# EAGLE design esp-rev2 (EAGLE 7.1.0)
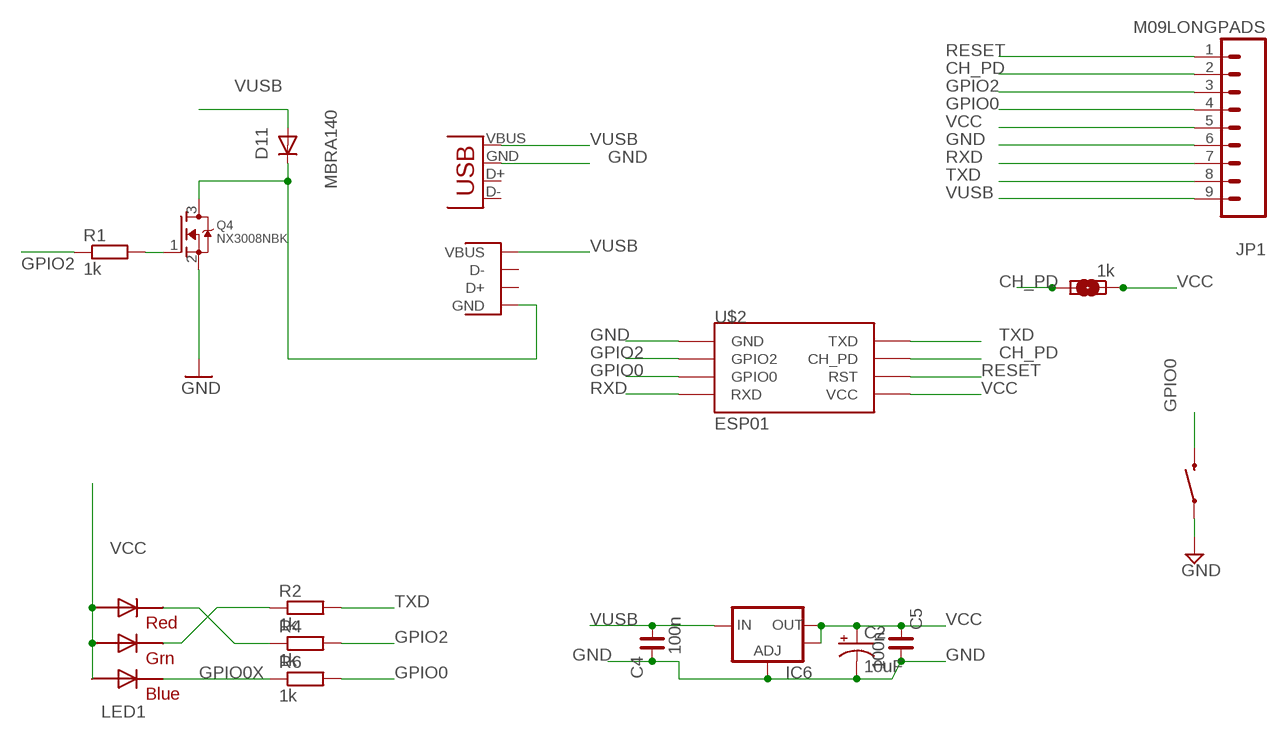
[diagram p0: schematic, sheet 1]

## Parts
C2  10uF  CAP_POL1206  [EIA3216]
C4  100n  C_0603  [C0603]
C5  100n  C_0603  [C0603]
D11  MBRA140  DIODESOD  [SOD-323]
IC6  V_REG_LM1117SOT223  [SOT223]
JP1  M09LONGPADS  [1X09_LONGPADS]
LED1  RGBLED5050  [RGBLED5050]
PWR2  SOLDERJUMPERTRACE  [SJ_2S-TRACE]
Q4  NX3008NBK  MOSFET-NWIDE  [SOT23-WIDE]
R1  1k  R-EU_R0603  [R0603]
R2  1k  R-EU_R0603  [R0603]
R4  1k  R-EU_R0603  [R0603]
R6  1k  R-EU_R0603  [R0603]
R8  1k  R-EU_R0603  [R0603]
RESET1  SWITCH-MOMENTARY-2-SMD-1101NE  [TACTILE-SWITCH-1101NE]
U$2  ESP01  [ESP01]
X1  USB-A-H  [USB-A-H]
X3  USB-A-H  [USB-A-H]

## Nets
CH_PD: JP1.2 PWR2.1 R8.2 U$2.CH_PD
GND: C2.C(-) C4.2 C5.1 IC6.1(ADJ) JP1.6 Q4.2(S) RESET1.P$1 U$2.GND X3.GND(VBUS)
GPIO0: JP1.4 R6.2 RESET1.P$2 U$2.GPIO0
GPIO0X: LED1.4(BLUE_C) R6.1
GPIO2: JP1.3 R1.1 R4.2 U$2.GPIO2
N$1: LED1.5(RED_C) R4.1
N$2: LED1.6(GREEN_C) R2.1
N$3: Q4.1(G) R1.2
N$7: D11.1(C) Q4.3(D) X1.GND
RESET: JP1.1 U$2.RST
RXD: JP1.7 U$2.RX(RXD)
TXD: JP1.8 R2.2 U$2.TX(TXD)
VCC: C2.A(+) C5.2 IC6.2(OUT) IC6.4(OUT) JP1.5 LED1.1(GREEN_A) LED1.2(RED_A) LED1.3(BLUE_A) PWR2.2 R8.1 U$2.VCC
VUSB: C4.1 D11.2(A) IC6.3(IN) JP1.9 X1.VBUS X3.VBUS(GND)
Unconnected: X1.D+ X1.D- X3.D+(D-) X3.D-(D+)

## Library data of the parts
C2 = SparkFun:CAP_POL: Capacitor Polarized These are standard SMD and PTH capacitors. Normally 10uF, 47uF, and 100uF in electrolytic and tantalum varieties. Always verify the external diameter of the through hole cap, it varies with capacity, voltage, and manufacturer. The EIA devices should be standard.
C4 C5 = rc-master-smd:C_: NON-POLARIZED CAP
D11 = SparkFun:DIODE: Diode These are standard reverse protection diodes and small signal diodes. SMA package can handle up to about 1A. SOD-323 can handle about 200mA. What the SOD-323 package when ordering, there are some mfgs out there that are 5-pin packages.
IC6 = SparkFun:V_REG_LM1117: Voltage Regulator LM1117 Standard adjustable voltage regulator but in SMD form. Spark Fun Electronics SKU : COM-00595
JP1 = SparkFun-Connectors:M09: Header 9 Standard 9-pin 0.1" header. Use with straight break away headers (SKU : PRT-00116), right angle break away headers (PRT-00553), swiss pins (PRT-00743), machine pins (PRT-00117), and female headers (PRT-00115).
LED1 = adafruit:RGBLED: For 5050 RGB LEDs, the order of the LEDs may vary from one manufacturer to another!
PWR2 = SparkFun:SOLDERJUMPER: Solder Jumper Standard SMD solder jumper. Used to automate production. Two varients : Normally Open and Normally Closed are the same, but have different paste layers. NC will have a large amount of paste and should jumper during reflow.
Q4 = microbuilder:MOSFET-N: N-Channel Mosfet LEGEND VDS: Voltage Drain-Source ID: Drain Current RDS(ON): Drain-Source On-State Resistance VGS(TH): Gate-Source Threshold Voltage CISS: Drain-Source Input Capacitance SOT-23 Name VDS ID RDS(ON) VGS(TH) CISS Order Number 2N7002E 60V 260mA 2.5 Ohm 2.5V @ 250uA 26.7pF @ 25V 2N7002ET1GOSTR-ND BSH103 30V 850mA 400 mOhm 400mV @ 1mA 83pF @ 24V BSH103,235-ND BSS138 60V 320mA 1.6 Ohm 1.5V @ 250uA 50pF @ 10V Mouser: 771-BSS138PW115 DMN2075U-7 20V 4.2A 38 mOhm 1V @ 250 uA 594.3pF @ 10V DMN2075U-7DICT-ND * BSS138 good choice for I2C level-shifting
R1 R2 R4 R6 R8 = resistor:R-EU_: RESISTOR, European symbol
RESET1 = SparkFun:SWITCH-MOMENTARY-2
U$2 = esp8266modules:ESP01: ESP8266 Wifi module 01
X1 = CH_connectors:USB: USB Connectors USB-B-PTH is C@H proven USB-A-H is C@H proven
X3 = SparkFun:USB: USB Connectors USB-B-PTH is fully proven SKU : PRT-00139 USB-miniB is fully proven SKU : PRT-00587 USB-A-PCB is untested. USB-A-H is throughly reviewed, but untested. Spark Fun Electronics SKU : PRT-00437 USB-B-SMT is throughly reviewed, but untested. Needs silkscreen touching up. USB-A-S has not been used/tested USB-MB-H has not been used/tested

## Net classes
0 default: width 0.254 mm, drill 0.381 mm, clearance 0.254 mm
1 GND: width 0.254 mm, drill 0.381 mm, clearance 0.254 mm
2 pwr: width 0.254 mm, drill 0.381 mm, clearance 0.254 mm

## Board
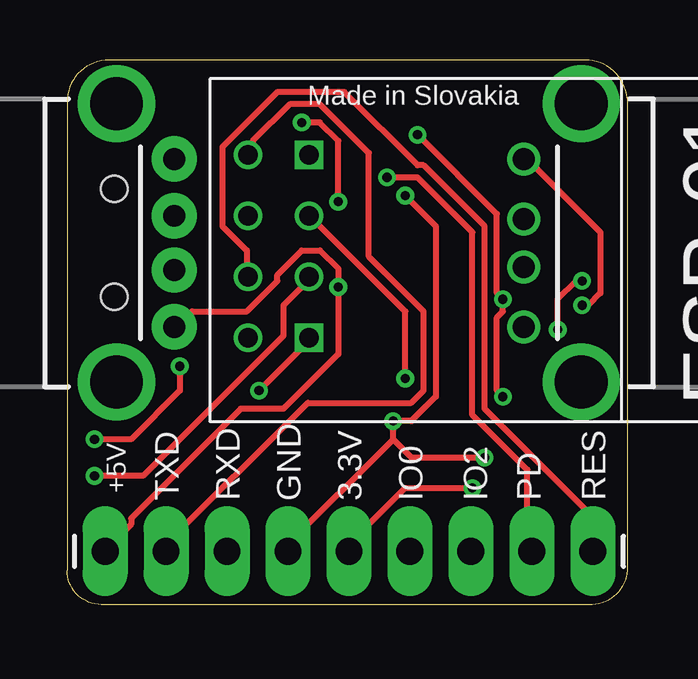
[diagram p1: board, top side]
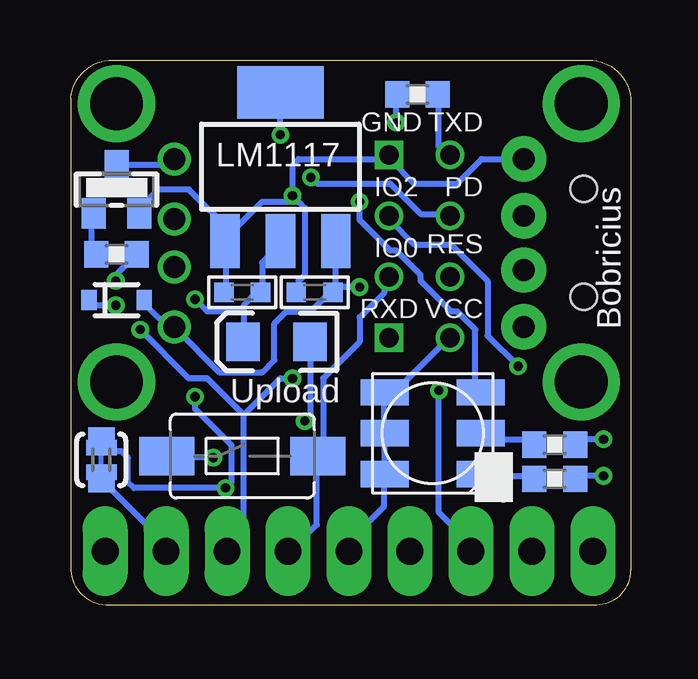
[diagram p2: board, bottom side, seen from below]

Size 23.34 x 22.71 mm. Coordinates in mm from the lower left corner, seen from the top.
Outline: 23.34,21.11 arc90 21.43,22.7 1.75,22.7 arc90 0,20.96 0,1.43 arc90 1.43,0 21.75,0 arc90 23.34,1.43 23.34,21.11
Copper layers (1*16): Top 0.0356mm / dielectric 1.5011mm / Bottom 0.0356mm
Design rules "LaenPCBOrder (1) *": minimum track width 6mil, minimum drill 13mil, track to track 8mil, track to pad 8mil, pad to pad 8mil, via to via 8mil, smd to smd 6mil, copper to edge 15mil, drill to drill 6mil, minimum pad ring 7mil, minimum via ring 7mil, stop-mask expansion 4mil, vias tented up to drill 30mil, thermal gap 10mil

### Footprints (pad centres in the part's own frame; a part is rotated, then mirrored left to right if it is on the bottom)
EIA3216 = smd 1.4 x 1.6: A 1.4,0; C -1.4,0
C0603 = smd 0.8 x 0.8: 1 -0.762,0; 2 0.762,0
SOD-323 = smd 0.63 x 0.83: 1 -1.15,0; 2 1.15,0
SOT223 = smd 1.219 x 2.235: 1 -2.311,-3.099; 2 0,-3.099; 3 2.311,-3.099 | smd 3.6 x 2.2: 4 0,3.099
1X09_LONGPADS = drill 1.118 pad 1.88 long: 1 0,0; 2 2.54,0; 3 5.08,0; 4 7.62,0; 5 10.16,0; 6 12.7,0; 7 15.24,0; 8 17.78,0; 9 20.32,0
RGBLED5050 = smd 2 x 1.1: 1 -2,1.7; 2 -2,0; 3 -2,-1.7; 4 2,-1.7; 5 2,0; 6 2,1.7
SJ_2S-TRACE = smd 0.635 x 1.27: 1 -0.508,0; 2 0.508,0
SOT23-WIDE = smd 1 x 1.27: 1 -0.95,-1; 2 0.95,-1; 3 0,1
R0603 = smd 1 x 1.1: 1 -0.85,0; 2 0.85,0
TACTILE-SWITCH-1101NE = smd 2.3 x 1.6: P$1 -3.15,0; P$2 3.15,0
ESP01 = drill 0.8: CH_PD -1.285,-8.178; GPIO0 1.255,-5.638; GPIO2 -1.285,-5.638; RST 1.255,-8.178; TX -3.825,-8.178; VCC 3.795,-8.178 | drill 0.8 square: GND -3.825,-5.638; RX 3.795,-5.638
USB-A-H = drill 0.914: D+ 2.4,-1; D- 2.4,1; GND 2.4,-3.5; VBUS 2.4,3.5 | drill 2.2: GND@1 0,5.8; GND@2 0,-5.8
USB-A-H' = drill 0.914 pad 1.88: D+ 2.4,1.127; D- 2.4,-1.127; GND 2.4,3.5; VBUS 2.4,-3.5 | drill 2.2: GND2 0,-5.8; GND3 0,5.8 | hole 1.1: -0.1,2.25; -0.1,-2.25

### Placement (x,y rotation side)
C2  14.76,10.95 180 bottom
C4  13.18,13.02 180 bottom
C5  16.19,13.02 0 bottom
D11  21.43,12.7 0 bottom
IC6  14.61,18.26 0 bottom
JP1  21.91,2.22 180 top
LED1  8.25,7.14 0 bottom
PWR2  22.07,6.03 90 bottom
Q4  21.43,17.3 0 bottom
R1  21.43,14.61 180 bottom
R2  8.89,21.27 0 bottom
R4  3.18,6.67 0 bottom
R6  3.18,5.24 0 bottom
R8  22.07,6.03 270 bottom
RESET1  16.19,6.19 0 bottom
U$2  15.72,14.92 270 top
X1  21.43,15.08 180 top
X3  USB-A-H  [USB-A-H']  2.06,15.08 0 top

### Tracks (layer width: path | path; a pad name or v marks a point on that pad's centre or on a via)
CH_PD  (via drill 0.38)
  Top 0.254: v13.34,17.81 14.61,17.81 16.89,15.53 16.89,7.91 19.18,5.62 19.18,2.32 JP1.2
  Bottom 0.254: PWR2.1 22.23,5.37 R8.2 21.97,5.11 19.18,2.32 JP1.2 | v13.34,17.81 13.08,17.56 10.03,17.56 8.76,16.29 7.75,16.29 U$2.CH_PD
GND  (via drill 0.38)
  Top 0.254: 13.59,6.89 v13.59,7.65 14.35,7.65 15.37,8.67 15.37,15.78 v14.1,17.05 | 13.59,6.89 9.02,2.32 JP1.6 | v17.4,6.13 14.35,6.13 13.59,6.89
  Bottom 0.254: v13.59,7.65 13.34,7.91 13.34,10.95 C2.C | v17.4,6.13 19.18,6.13 RESET1.P$1 | 14.1,16.8 15.37,16.8 16.64,15.53 | 14.1,16.8 13.84,16.8 13.59,16.54 13.59,13.75 13.84,13.49 13.84,13.24 C4.2 | 16.64,15.53 16.89,15.27 IC6.1 | C5.1 16.89,13.24 16.89,15.02 IC6.1 | 16.64,15.53 18.41,17.3 19.69,17.3 20.45,16.54 Q4.2 | 16.64,15.53 IC6.1 | 14.1,16.8 v14.1,17.05 14.1,18.32 13.84,18.57 10.29,18.57 U$2.GND 10.03,18.57 9.02,17.56 7.24,17.56 6.22,18.57 4.7,18.57 X3.GND
GPIO0  (via drill 0.38)
  Top 0.254: v1.14,5.37 3.18,5.37 9.02,11.21 9.02,12.48 10.03,13.49 U$2.GPIO0
  Bottom 0.254: JP1.4 14.1,2.32 13.08,3.33 13.08,6.13 RESET1.P$2 12.83,6.38 12.83,9.43 11.3,10.95 11.3,11.97 10.29,12.99 10.29,13.49 U$2.GPIO0 | v1.14,5.37 2.16,5.37 R6.2
GPIO0X
  Bottom 0.254: R6.1 4.19,5.37 6.22,5.37 LED1.4
GPIO2  (via drill 0.38)
  Top 0.254: v1.14,6.89 2.67,6.89 4.7,8.92 v4.7,9.94 | v21.46,13.49 21.21,13.49 20.45,12.73 v20.45,11.46 | v14.1,9.43 14.1,12.22 10.29,16.03 U$2.GPIO2
  Bottom 0.254: v1.14,6.89 2.16,6.89 R4.2 | v4.7,9.94 5.97,11.21 5.97,13.49 7.49,15.02 9.02,15.02 10.03,16.03 U$2.GPIO2 | v21.46,13.49 21.46,13.75 20.7,14.51 R1.1 | v20.45,11.46 18.41,9.43 17.65,9.43 16.13,7.91 | 16.13,7.91 16.13,2.83 16.64,2.32 JP1.3 | v14.1,9.43 14.61,9.43 16.13,7.91
N$1
  Bottom 0.254: R4.1 4.19,6.89 5.97,6.89 6.22,7.14 LED1.5
N$2  (via drill 0.38)
  Top 0.254: v9.78,20.1 10.54,20.1 11.3,19.34 v11.3,16.8
  Bottom 0.254: v9.78,20.1 9.78,21.11 R2.1 | v11.3,16.8 11.3,16.03 10.03,14.76 9.78,14.76 8.76,13.75 8.76,13.49 7.49,12.22 7.24,12.22 6.48,11.46 6.48,8.92 LED1.6
N$3
  Bottom 0.254: R1.2 22.48,14.76 22.48,16.29 Q4.1
N$7  (via drill 0.38)
  Top 0.254: v21.46,12.48 21.72,12.48 22.23,12.99 22.23,15.53 19.18,18.57 X1.GND
  Bottom 0.254: v21.46,12.48 22.48,12.48 D11.1 | Q4.3 21.21,18.32 19.43,18.32 19.18,18.57 X1.GND
RESET
  Top 0.254: U$2.RST 7.49,13.75 7.49,14.76 6.48,15.78 6.48,19.08 8.76,21.37 11.56,21.37 14.61,18.32 14.86,18.32 17.4,15.78 17.4,8.16 21.72,3.84 21.72,2.32 JP1.1
RXD  (via drill 0.38)
  Top 0.254: v8,8.92 10.03,10.95 U$2.RX
  Bottom 0.254: v8,8.92 8,3.84 6.48,2.32 JP1.7
TXD
  Top 0.254: U$2.TX 7.75,18.83 7.75,19.34 9.27,20.86 10.54,20.86 12.57,18.83 12.57,14.51 14.86,12.22 14.86,8.92 14.35,8.41 10.03,8.41 3.94,2.32 JP1.8
  Bottom 0.254: R2.2 8,21.11 8,19.08 7.75,18.83 U$2.TX
VCC  (via drill 0.38)
  Top 0.254: v14.61,19.59 17.91,16.29 17.91,12.99 v18.16,12.73 18.16,12.22 17.91,11.97 17.91,8.92 v18.16,8.67 | v16.89,4.86 14.1,4.86 11.56,2.32 JP1.5
  Bottom 0.254: IC6.2 14.61,15.02 15.37,14.26 15.37,13.24 C5.2 15.62,12.99 16.13,12.48 16.13,12.22 | 16.13,12.22 16.13,10.95 C2.A | v14.61,19.59 IC6.4 | v18.16,12.73 17.65,12.22 16.13,12.22 | 10.29,7.14 10.29,5.62 LED1.3 10.29,5.37 10.29,4.1 11.56,2.83 11.56,2.32 JP1.5 | 10.29,7.14 10.29,8.67 LED1.1 10.03,8.67 7.75,10.95 U$2.VCC | 10.29,7.14 LED1.2 | R8.1 22.23,6.64 PWR2.2 21.97,6.38 21.21,6.38 20.95,6.13 20.95,5.11 20.7,4.86 v16.89,4.86 16.64,5.11 16.64,6.64 18.16,8.16 v18.16,8.67
VUSB  (via drill 0.38)
  Top 0.254: JP1.9 1.65,2.32 2.67,3.33 2.67,3.59 7.24,8.16 9.02,8.16 11.3,10.45 v11.3,13.24 11.3,14 10.54,14.76 9.78,14.76 8.76,13.75 8.76,13.49 7.49,12.22 5.21,12.22 4.7,11.72 X3.VBUS
  Bottom 0.254: 12.32,13.24 12.32,15.02 IC6.3 | D11.2 20.19,12.48 19.18,11.46 X1.VBUS 18.92,11.46 17.14,9.68 15.37,9.68 14.86,10.19 14.86,11.72 14.35,12.22 13.34,12.22 12.57,12.99 C4.1 12.32,13.24 | v11.3,13.24 12.32,13.24

### Text on the board
tNames: Made in Slovakia | +5V | TXD | RXD | GND | 3.3V | IO0 | IO2 | PD | RES
bNames: TXD | GND | PD | IO2 | LM1117 | RES | IO0 | VCC | RXD | Bobricius | Upload